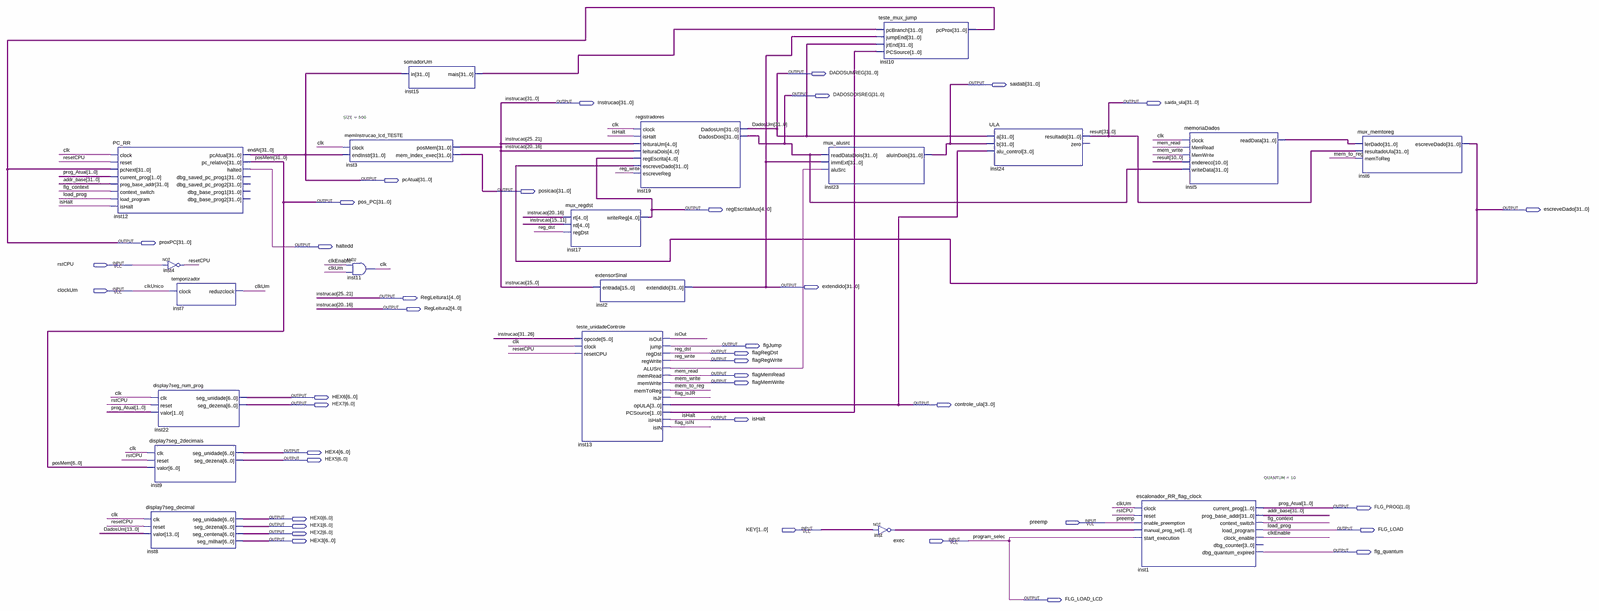
[diagram p0: schematic sheet, whole]
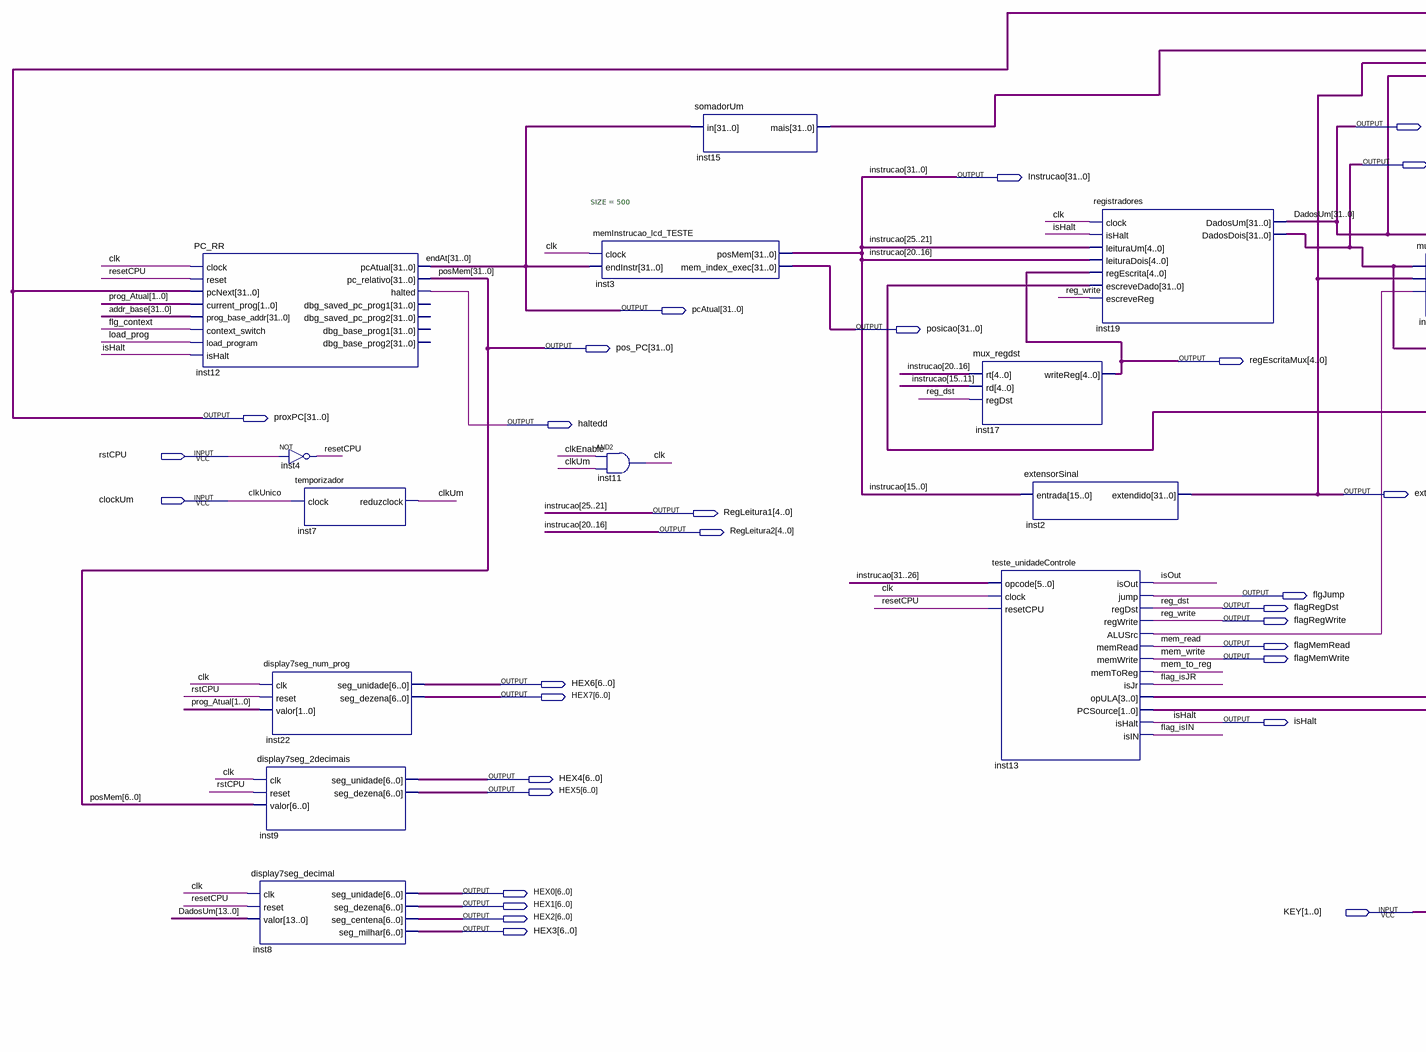
[diagram p1: schematic sheet, left part]
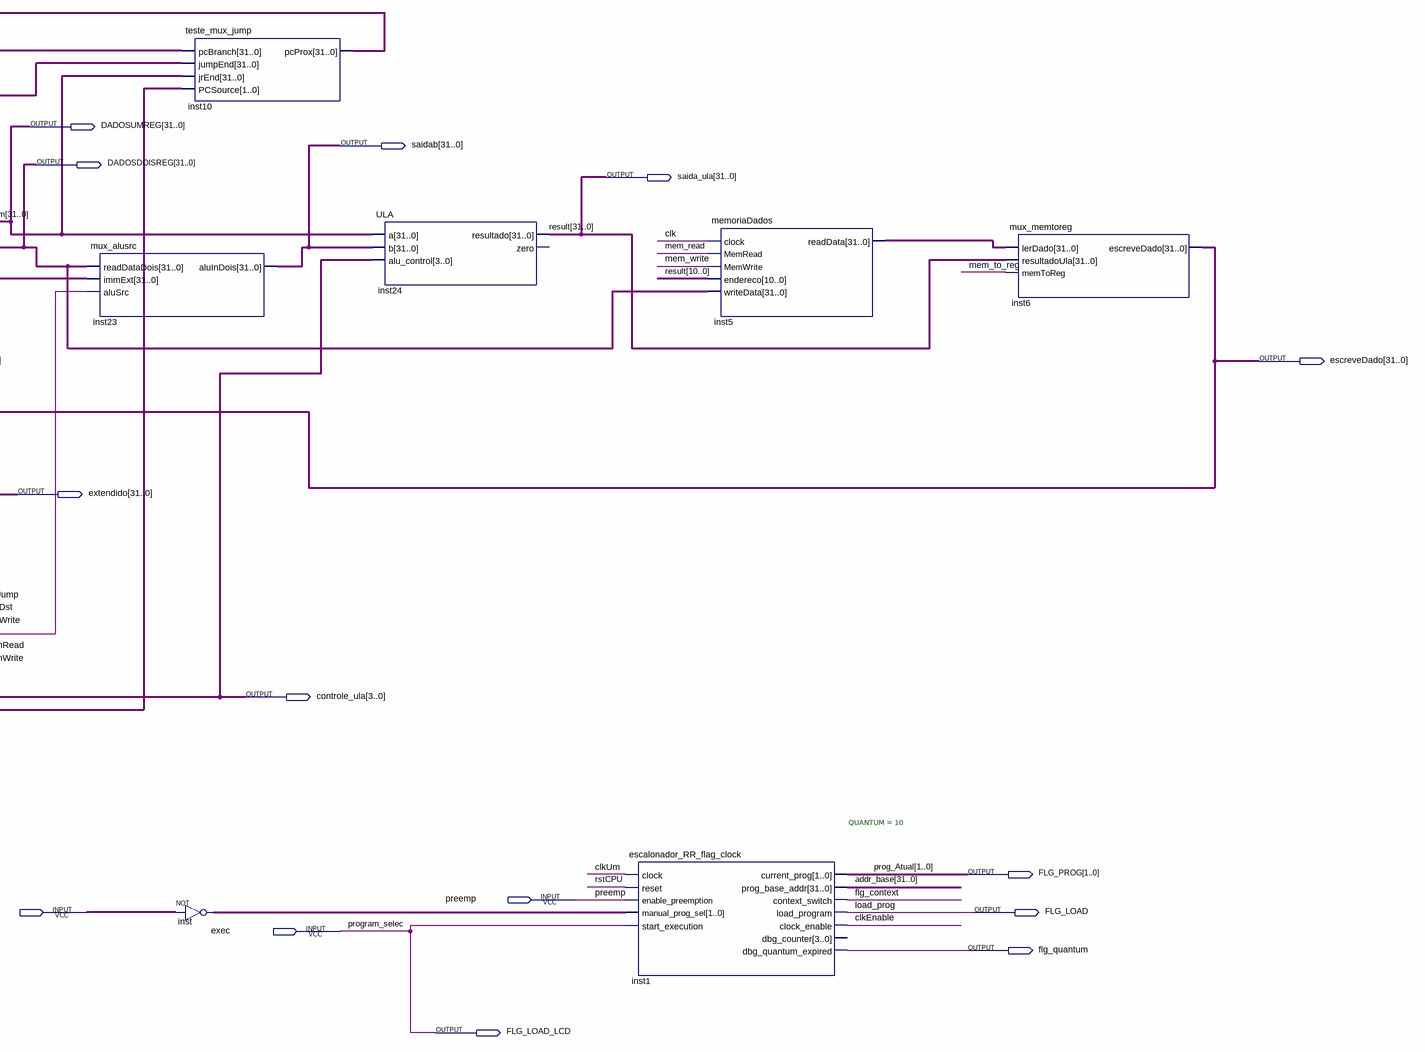
[diagram p2: schematic sheet, right part]
// Quartus schematic testeIntegrado_ajustado.bdf as structural Verilog: 20 symbols, 39 pins
module testeIntegrado_ajustado (
  input  rstCPU,
  input  clockUm,
  input  preemp,
  input  [1:0] KEY,
  input  exec,
  output [31:0] DADOSUMREG,
  output [31:0] saidab,
  output [31:0] DADOSDOISREG,
  output [31:0] Instrucao,
  output [31:0] saida_ula,
  output [31:0] pcAtual,
  output [31:0] posicao,
  output [31:0] pos_PC,
  output [4:0] regEscritaMux,
  output [31:0] escreveDado,
  output [31:0] proxPC,
  output haltedd,
  output [31:0] extendido,
  output [4:0] RegLeitura1,
  output [4:0] RegLeitura2,
  output flgJump,
  output flagRegDst,
  output flagRegWrite,
  output flagMemRead,
  output flagMemWrite,
  output [6:0] HEX6,
  output [6:0] HEX7,
  output [3:0] controle_ula,
  output isHalt,
  output [6:0] HEX4,
  output [6:0] HEX5,
  output [1:0] FLG_PROG,
  output [6:0] HEX0,
  output [6:0] HEX1,
  output FLG_LOAD,
  output [6:0] HEX2,
  output [6:0] HEX3,
  output flg_quantum,
  output FLG_LOAD_LCD
);

  wire clk, clkEnable, clkUm, flag_isIN, flag_isJR, flg_context, inst13_alusrc, isOut, mem_to_reg, resetCPU;
  wire [1:0] inst13_pcsource, inst_out;
  wire [31:0] addr_base, inst5_readdata, inst15_mais;

  PC_RR inst12 (
    .clock(clk), .reset(resetCPU), .pcNext(proxPC), .current_prog(FLG_PROG), .prog_base_addr(addr_base),
    .context_switch(flg_context), .load_program(FLG_LOAD), .isHalt(isHalt), .pcAtual(pcAtual),
    .pc_relativo(pos_PC), .halted(haltedd));  // open: dbg_saved_pc_prog1, dbg_saved_pc_prog2, dbg_base_prog1, dbg_base_prog2
  display7seg_num_prog inst22 (.clk(clk), .reset(rstCPU), .valor(FLG_PROG), .seg_unidade(HEX6), .seg_dezena(HEX7));
  display7seg_2decimais inst9 (.clk(clk), .reset(rstCPU), .valor(pos_PC[6:0]), .seg_unidade(HEX4), .seg_dezena(HEX5));
  display7seg_decimal inst8 (
    .clk(clk), .reset(resetCPU), .valor(DADOSUMREG[13:0]), .seg_unidade(HEX0), .seg_dezena(HEX1),
    .seg_centena(HEX2), .seg_milhar(HEX3));
  not inst4 (resetCPU, rstCPU);
  temporizador inst7 (.clock(clockUm), .reduzclock(clkUm));
  memInstrucao_lcd_TESTE #(.SIZE(500)) inst3 (
    .clock(clk), .endInstr(pcAtual), .posMem(Instrucao), .mem_index_exec(posicao));
  and inst11 (clk, clkEnable, clkUm);
  somadorUm inst15 (.in(pcAtual), .mais(inst15_mais));
  mux_regdst inst17 (.rt(Instrucao[20:16]), .rd(Instrucao[15:11]), .regDst(flagRegDst), .writeReg(regEscritaMux));
  extensorSinal inst2 (.entrada(Instrucao[15:0]), .extendido(extendido));
  teste_unidadeControle inst13 (
    .opcode(Instrucao[31:26]), .clock(clk), .resetCPU(resetCPU), .isOut(isOut), .jump(flgJump),
    .regDst(flagRegDst), .regWrite(flagRegWrite), .ALUSrc(inst13_alusrc), .memRead(flagMemRead),
    .memWrite(flagMemWrite), .memToReg(mem_to_reg), .isJr(flag_isJR), .opULA(controle_ula),
    .PCSource(inst13_pcsource), .isHalt(isHalt), .isIN(flag_isIN));
  registradores inst19 (
    .clock(clk), .isHalt(isHalt), .leituraUm(Instrucao[25:21]), .leituraDois(Instrucao[20:16]),
    .regEscrita(regEscritaMux), .escreveDado(escreveDado), .escreveReg(flagRegWrite), .DadosUm(DADOSUMREG),
    .DadosDois(DADOSDOISREG));
  mux_alusrc inst23 (.readDataDois(DADOSDOISREG), .immExt(extendido), .aluSrc(inst13_alusrc), .aluInDois(saidab));
  teste_mux_jump inst10 (
    .pcBranch(inst15_mais), .jumpEnd(extendido), .jrEnd(DADOSUMREG), .PCSource(inst13_pcsource),
    .pcProx(proxPC));
  assign inst_out = ~KEY;  // NOT inst, 2 bits wide
  ULA inst24 (.a(DADOSUMREG), .b(saidab), .alu_control(controle_ula), .resultado(saida_ula));  // open: zero
  escalonador_RR_flag_clock #(.QUANTUM(10)) inst1 (
    .clock(clkUm), .reset(rstCPU), .enable_preemption(preemp), .manual_prog_sel(inst_out),
    .start_execution(exec), .current_prog(FLG_PROG), .prog_base_addr(addr_base),
    .context_switch(flg_context), .load_program(FLG_LOAD), .clock_enable(clkEnable),
    .dbg_quantum_expired(flg_quantum));  // open: dbg_counter
  memoriaDados inst5 (
    .clock(clk), .MemRead(flagMemRead), .MemWrite(flagMemWrite), .endereco(saida_ula[10:0]),
    .writeData(DADOSDOISREG), .readData(inst5_readdata));
  mux_memtoreg inst6 (
    .lerDado(inst5_readdata), .resultadoUla(saida_ula), .memToReg(mem_to_reg), .escreveDado(escreveDado));

  assign FLG_LOAD_LCD = exec;
  assign RegLeitura1 = Instrucao[25:21];
  assign RegLeitura2 = Instrucao[20:16];

  // Other names for the same wires on the sheet: clkUnico = clockUm; DadosUm[31:0] = DADOSUMREG;
  //   endAt[31:0] = pcAtual; load_prog = FLG_LOAD; mem_read = flagMemRead; mem_write = flagMemWrite;
  //   posMem[31:0] = pos_PC; prog_Atual[1:0] = FLG_PROG; program_selec = exec; reg_dst = flagRegDst;
  //   reg_write = flagRegWrite; result[31:0] = saida_ula
endmodule
